# EAGLE schematic snesram (EAGLE 5.06)
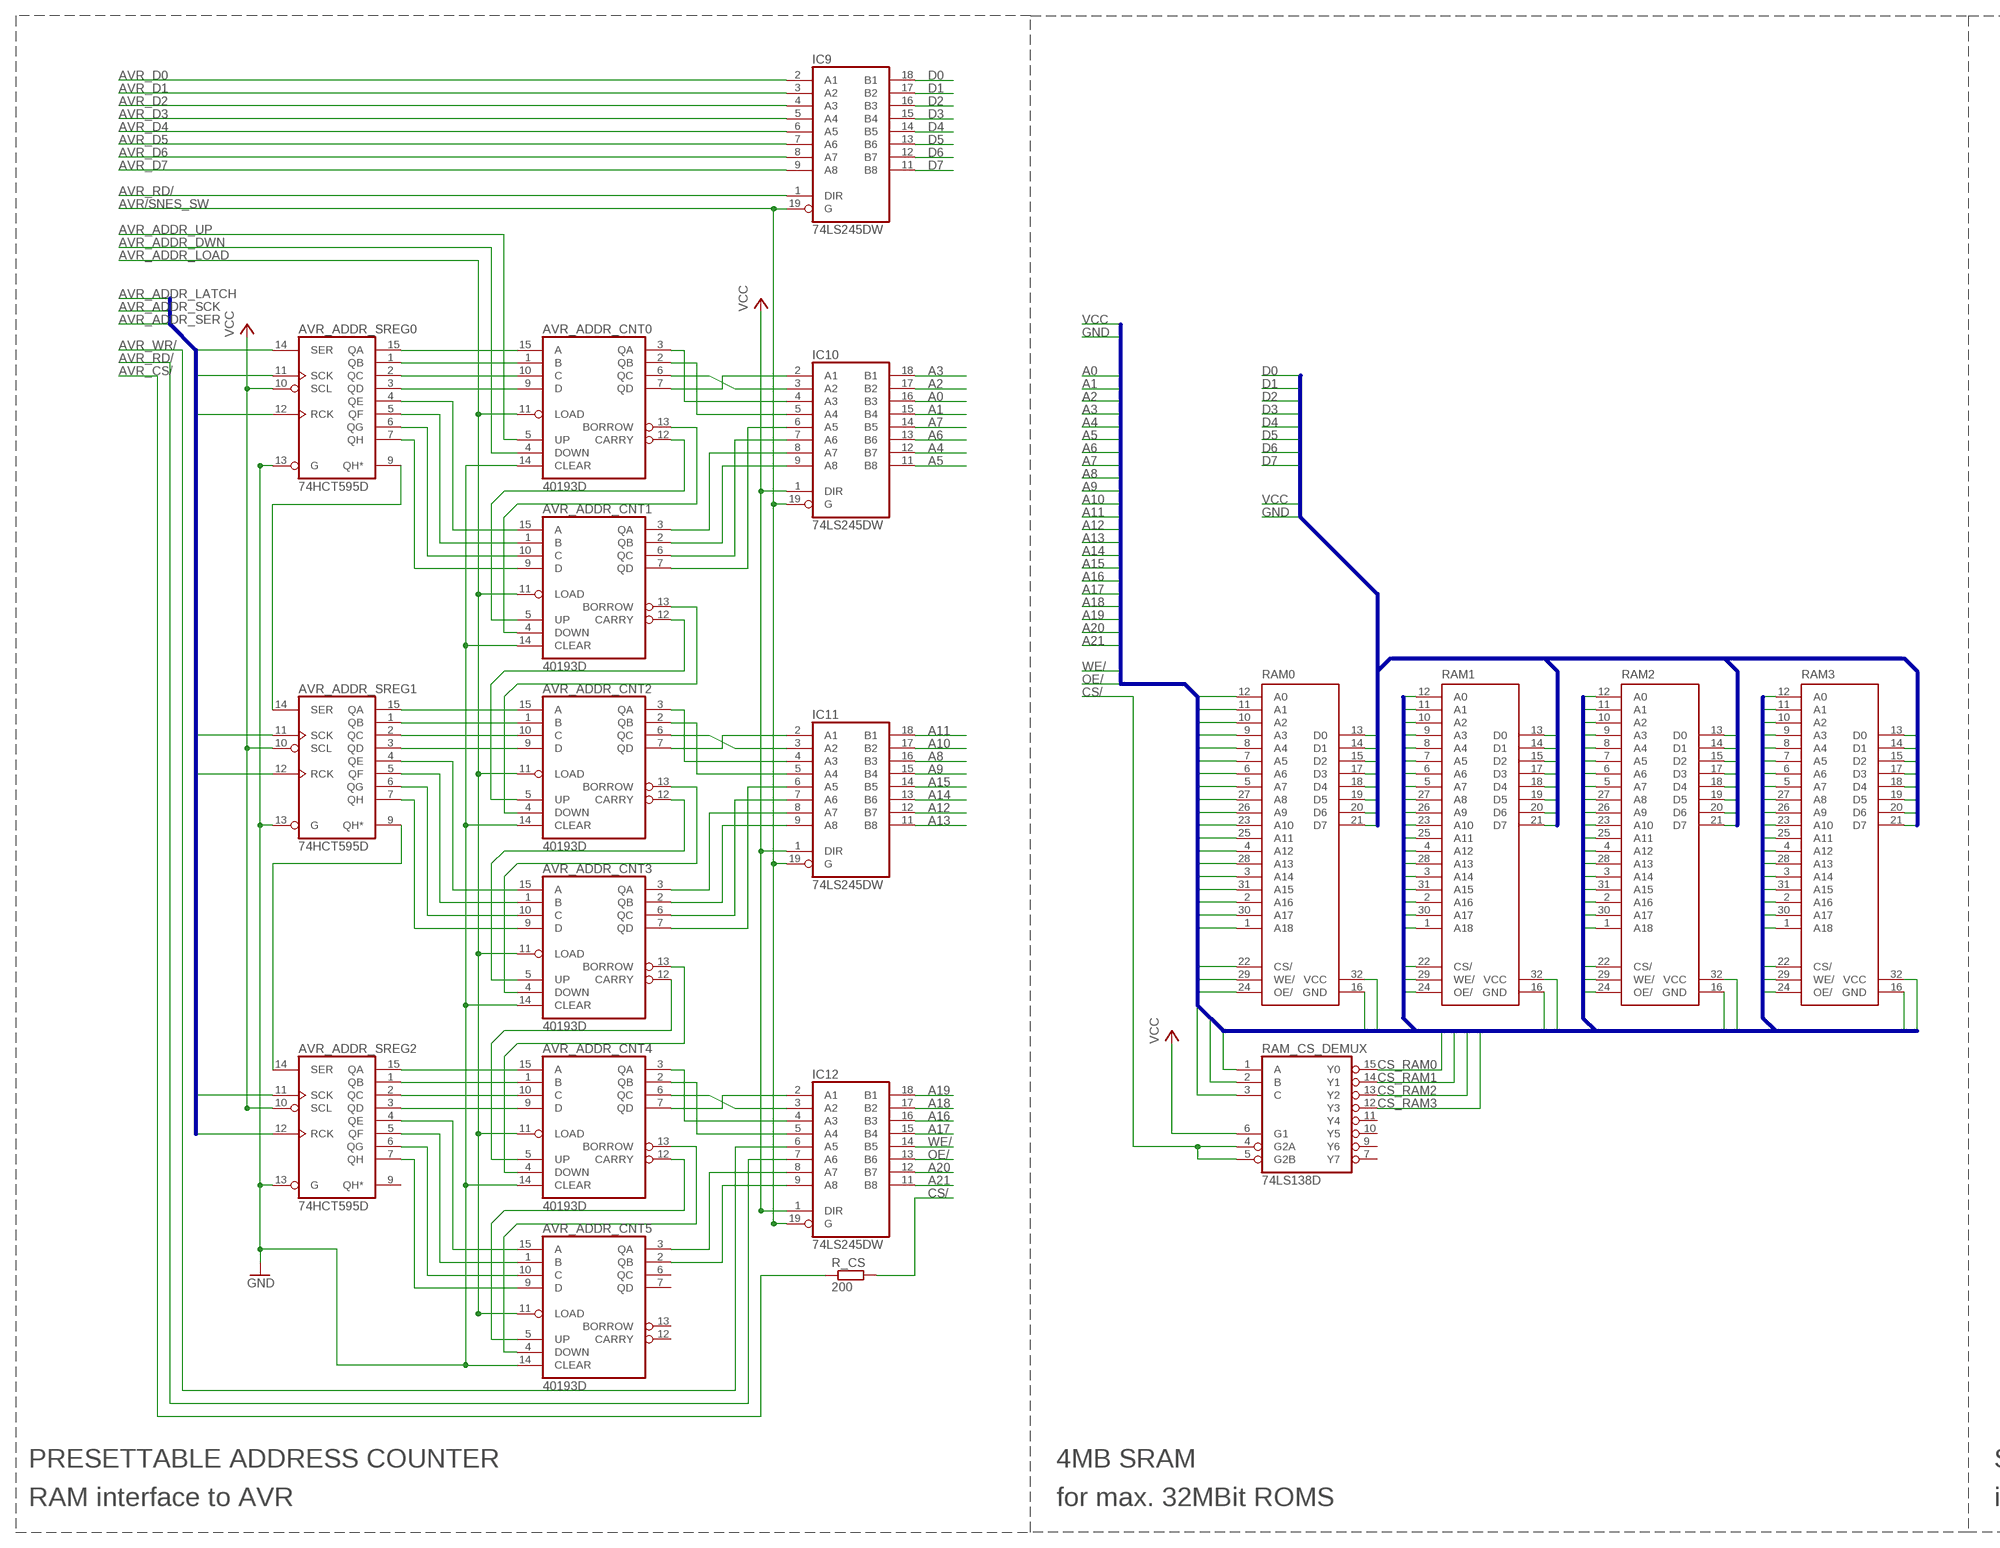
[diagram p0: schematic, sheet 1, part 1 of 2]
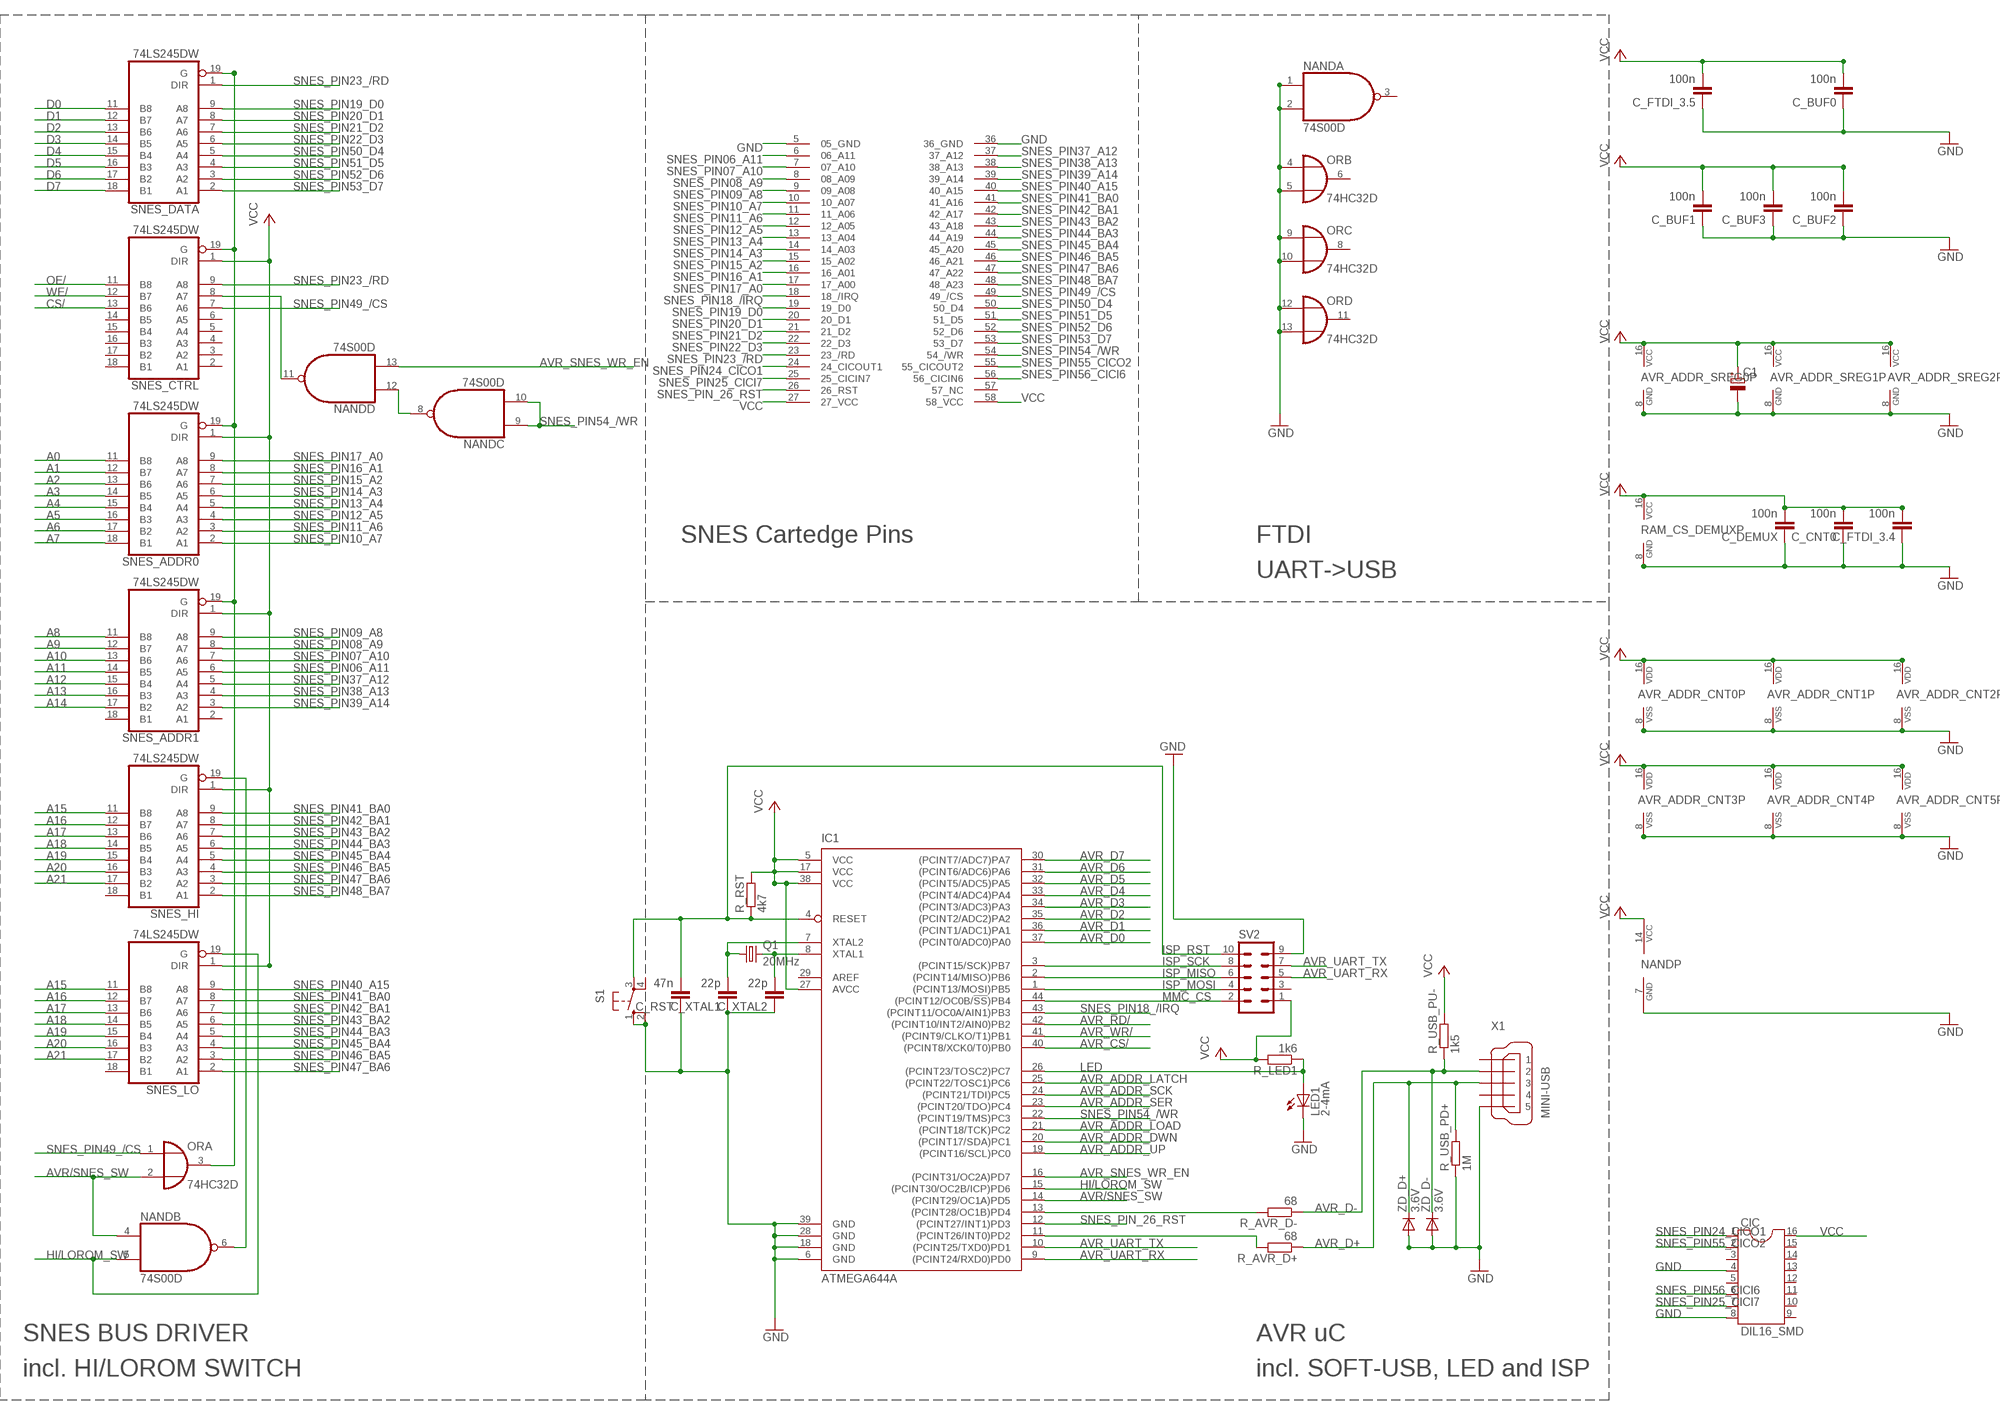
[diagram p1: schematic, sheet 1, part 2 of 2]

## Parts
AVR_ADDR_CNT0  40193D  [SO16]
AVR_ADDR_CNT1  40193D  [SO16]
AVR_ADDR_CNT2  40193D  [SO16]
AVR_ADDR_CNT3  40193D  [SO16]
AVR_ADDR_CNT4  40193D  [SO16]
AVR_ADDR_CNT5  40193D  [SO16]
AVR_ADDR_SREG0  74HCT595D  [SO16]
AVR_ADDR_SREG1  74HCT595D  [SO16]
AVR_ADDR_SREG2  74HCT595D  [SO16]
C1  CPOL-EUSMCC  [SMC_C]
C_BUF0  100n  C-EUC0805  [C0805]
C_BUF1  100n  C-EUC0805  [C0805]
C_BUF2  100n  C-EUC0805  [C0805]
C_BUF3  100n  C-EUC0805  [C0805]
C_CNT0  100n  C-EUC0805  [C0805]
C_DEMUX  100n  C-EUC0805  [C0805]
C_FTDI_3.4  100n  C-EUC0805  [C0805]
C_FTDI_3.5  100n  C-EUC0805  [C0805]
C_RST  47n  C-EUC0805  [C0805]
C_XTAL1  22p  C-EUC0805  [C0805]
C_XTAL2  22p  C-EUC0805  [C0805]
CIC  DIL16_SMD  [DIL16_SMD]
IC1  ATMEGA644A  [TQFP44]
IC9  74LS245DW  [SO20W]
IC10  74LS245DW  [SO20W]
IC11  74LS245DW  [SO20W]
IC12  74LS245DW  [SO20W]
LED1  2-4mA  LEDCHIPLED_0805  [CHIPLED_0805]
NAND  74S00D  [SO14]
OR  74HC32D  [SO14]
Q1  20MHz  CRYSTALHC49UP  [HC49UP]
R_AVR_D+  68  R-EU_R0805  [R0805]
R_AVR_D-  68  R-EU_R0805  [R0805]
R_CS  200  R-EU_R0805  [R0805]
R_LED1  1k6  R-EU_R0805  [R0805]
R_RST  4k7  R-EU_R0805  [R0805]
R_USB_PD+  1M  R-EU_R0805  [R0805]
R_USB_PU-  1k5  R-EU_R0805  [R0805]
RAM0  KM628512-XX  [SOP-32]
RAM1  KM628512-XX  [SOP-32]
RAM2  KM628512-XX  [SOP-32]
RAM3  KM628512-XX  [SOP-32]
RAM_CS_DEMUX  74LS138D  [SO16]
S1  10-XX  [B3F-10XX]
SNES_ADDR0  74LS245DW  [SO20W]
SNES_ADDR1  74LS245DW  [SO20W]
SNES_CTRL  74LS245DW  [SO20W]
SNES_DATA  74LS245DW  [SO20W]
SNES_HI  74LS245DW  [SO20W]
SNES_LO  74LS245DW  [SO20W]
SV2  ML10  [ML10]
U$3  SNES_CON_FRONT  [SNES_CON]
X1  MINI-USB  MINI-USB-32005-201  [32005-201]
ZD_D+  3.6V  DIODE-MINIMELF  [MINIMELF]
ZD_D-  3.6V  DIODE-MINIMELF  [MINIMELF]

## Nets
A0: IC10.16(B3) RAM0.12(A0) RAM1.12(A0) RAM2.12(A0) RAM3.12(A0) SNES_ADDR0.11(B8)
A1: IC10.15(B4) RAM0.11(A1) RAM1.11(A1) RAM2.11(A1) RAM3.11(A1) SNES_ADDR0.12(B7)
A2: IC10.17(B2) RAM0.10(A2) RAM1.10(A2) RAM2.10(A2) RAM3.10(A2) SNES_ADDR0.13(B6)
A3: IC10.18(B1) RAM0.9(A3) RAM1.9(A3) RAM2.9(A3) RAM3.9(A3) SNES_ADDR0.14(B5)
A4: IC10.12(B7) RAM0.8(A4) RAM1.8(A4) RAM2.8(A4) RAM3.8(A4) SNES_ADDR0.15(B4)
A5: IC10.11(B8) RAM0.7(A5) RAM1.7(A5) RAM2.7(A5) RAM3.7(A5) SNES_ADDR0.16(B3)
A6: IC10.13(B6) RAM0.6(A6) RAM1.6(A6) RAM2.6(A6) RAM3.6(A6) SNES_ADDR0.17(B2)
A7: IC10.14(B5) RAM0.5(A7) RAM1.5(A7) RAM2.5(A7) RAM3.5(A7) SNES_ADDR0.18(B1)
A8: IC11.16(B3) RAM0.27(A8) RAM1.27(A8) RAM2.27(A8) RAM3.27(A8) SNES_ADDR1.11(B8)
A9: IC11.15(B4) RAM0.26(A9) RAM1.26(A9) RAM2.26(A9) RAM3.26(A9) SNES_ADDR1.12(B7)
A10: IC11.17(B2) RAM0.23(A10) RAM1.23(A10) RAM2.23(A10) RAM3.23(A10) SNES_ADDR1.13(B6)
A11: IC11.18(B1) RAM0.25(A11) RAM1.25(A11) RAM2.25(A11) RAM3.25(A11) SNES_ADDR1.14(B5)
A12: IC11.12(B7) RAM0.4(A12) RAM1.4(A12) RAM2.4(A12) RAM3.4(A12) SNES_ADDR1.15(B4)
A13: IC11.11(B8) RAM0.28(A13) RAM1.28(A13) RAM2.28(A13) RAM3.28(A13) SNES_ADDR1.16(B3)
A14: IC11.13(B6) RAM0.3(A14) RAM1.3(A14) RAM2.3(A14) RAM3.3(A14) SNES_ADDR1.17(B2)
A15: IC11.14(B5) RAM0.31(A15) RAM1.31(A15) RAM2.31(A15) RAM3.31(A15) SNES_HI.11(B8) SNES_LO.11(B8)
A16: IC12.16(B3) RAM0.2(A16) RAM1.2(A16) RAM2.2(A16) RAM3.2(A16) SNES_HI.12(B7) SNES_LO.12(B7)
A17: IC12.15(B4) RAM0.30(A17) RAM1.30(A17) RAM2.30(A17) RAM3.30(A17) SNES_HI.13(B6) SNES_LO.13(B6)
A18: IC12.17(B2) RAM0.1(A18) RAM1.1(A18) RAM2.1(A18) RAM3.1(A18) SNES_HI.14(B5) SNES_LO.14(B5)
A19: IC12.18(B1) RAM_CS_DEMUX.1(A) SNES_HI.15(B4) SNES_LO.15(B4)
A20: IC12.12(B7) RAM_CS_DEMUX.2(B) SNES_HI.16(B3) SNES_LO.16(B3)
A21: IC12.11(B8) RAM_CS_DEMUX.3(C) SNES_HI.17(B2) SNES_LO.17(B2)
AVR/SNES_SW: IC1.14((PCINT29/OC1A)PD5) IC9.19(G) IC10.19(G) IC11.19(G) IC12.19(G) NAND.4(B:I0) OR.2(A:I1)
AVR/SNES_SW_INV: OR.3(A:O) SNES_ADDR0.19(G) SNES_ADDR1.19(G) SNES_CTRL.19(G) SNES_DATA.19(G)
AVR_ADDR_DWN: AVR_ADDR_CNT0.4(DOWN) IC1.20((PCINT17/SDA)PC1)
AVR_ADDR_LATCH: AVR_ADDR_SREG0.12(RCK) AVR_ADDR_SREG1.12(RCK) AVR_ADDR_SREG2.12(RCK) IC1.25((PCINT22/TOSC1)PC6)
AVR_ADDR_LOAD: AVR_ADDR_CNT0.11(LOAD) AVR_ADDR_CNT1.11(LOAD) AVR_ADDR_CNT2.11(LOAD) AVR_ADDR_CNT3.11(LOAD) AVR_ADDR_CNT4.11(LOAD) AVR_ADDR_CNT5.11(LOAD) IC1.21((PCINT18/TCK)PC2)
AVR_ADDR_SCK: AVR_ADDR_SREG0.11(SCK) AVR_ADDR_SREG1.11(SCK) AVR_ADDR_SREG2.11(SCK) IC1.24((PCINT21/TDI)PC5)
AVR_ADDR_SER: AVR_ADDR_SREG0.14(SER) IC1.23((PCINT20/TDO)PC4)
AVR_ADDR_UP: AVR_ADDR_CNT0.5(UP) IC1.19((PCINT16/SCL)PC0)
AVR_CS/: IC1.40((PCINT8/XCK0/T0)PB0) R_CS.1
AVR_D0: IC1.37((PCINT0/ADC0)PA0) IC9.2(A1)
AVR_D1: IC1.36((PCINT1/ADC1)PA1) IC9.3(A2)
AVR_D2: IC1.35((PCINT2/ADC2)PA2) IC9.4(A3)
AVR_D3: IC1.34((PCINT3/ADC3)PA3) IC9.5(A4)
AVR_D4: IC1.33((PCINT4/ADC4)PA4) IC9.6(A5)
AVR_D5: IC1.32((PCINT5/ADC5)PA5) IC9.7(A6)
AVR_D6: IC1.31((PCINT6/ADC6)PA6) IC9.8(A7)
AVR_D7: IC1.30((PCINT7/ADC7)PA7) IC9.9(A8)
AVR_D+: R_AVR_D+.1 R_USB_PD+.2 X1.3 ZD_D+.C
AVR_D-: R_AVR_D-.1 R_USB_PU-.1 X1.2 ZD_D-.C
AVR_RD/: IC1.42((PCINT10/INT2/AIN0)PB2) IC9.1(DIR) IC12.7(A6)
AVR_SNES_WR_EN: IC1.16((PCINT31/OC2A)PD7) NAND.13(D:I1)
AVR_UART_RX: IC1.9((PCINT24/RXD0)PD0) SV2.5
AVR_UART_TX: IC1.10((PCINT25/TXD0)PD1) SV2.7
AVR_WR/: IC1.41((PCINT9/CLKO/T1)PB1) IC12.6(A5)
CS/: R_CS.2 RAM_CS_DEMUX.4(G2A) RAM_CS_DEMUX.5(G2B) SNES_CTRL.13(B6)
CS_RAM0: RAM0.22(CS/) RAM_CS_DEMUX.15(Y0)
CS_RAM1: RAM1.22(CS/) RAM_CS_DEMUX.14(Y1)
CS_RAM2: RAM2.22(CS/) RAM_CS_DEMUX.13(Y2)
CS_RAM3: RAM3.22(CS/) RAM_CS_DEMUX.12(Y3)
D0: IC9.18(B1) RAM0.13(D0) RAM1.13(D0) RAM2.13(D0) RAM3.13(D0) SNES_DATA.11(B8)
D1: IC9.17(B2) RAM0.14(D1) RAM1.14(D1) RAM2.14(D1) RAM3.14(D1) SNES_DATA.12(B7)
D2: IC9.16(B3) RAM0.15(D2) RAM1.15(D2) RAM2.15(D2) RAM3.15(D2) SNES_DATA.13(B6)
D3: IC9.15(B4) RAM0.17(D3) RAM1.17(D3) RAM2.17(D3) RAM3.17(D3) SNES_DATA.14(B5)
D4: IC9.14(B5) RAM0.18(D4) RAM1.18(D4) RAM2.18(D4) RAM3.18(D4) SNES_DATA.15(B4)
D5: IC9.13(B6) RAM0.19(D5) RAM1.19(D5) RAM2.19(D5) RAM3.19(D5) SNES_DATA.16(B3)
D6: IC9.12(B7) RAM0.20(D6) RAM1.20(D6) RAM2.20(D6) RAM3.20(D6) SNES_DATA.17(B2)
D7: IC9.11(B8) RAM0.21(D7) RAM1.21(D7) RAM2.21(D7) RAM3.21(D7) SNES_DATA.18(B1)
GND: AVR_ADDR_CNT0.8(VSS) AVR_ADDR_CNT0.14(CLEAR) AVR_ADDR_CNT1.8(VSS) AVR_ADDR_CNT1.14(CLEAR) AVR_ADDR_CNT2.8(VSS) AVR_ADDR_CNT2.14(CLEAR) AVR_ADDR_CNT3.8(VSS) AVR_ADDR_CNT3.14(CLEAR) AVR_ADDR_CNT4.8(VSS) AVR_ADDR_CNT4.14(CLEAR) AVR_ADDR_CNT5.8(VSS) AVR_ADDR_CNT5.14(CLEAR) AVR_ADDR_SREG0.8(GND) AVR_ADDR_SREG0.13(G) AVR_ADDR_SREG1.8(GND) AVR_ADDR_SREG1.13(G) AVR_ADDR_SREG2.8(GND) AVR_ADDR_SREG2.13(G) C1.- C_BUF0.1 C_BUF1.1 C_BUF2.1 C_BUF3.1 C_CNT0.1 C_DEMUX.1 C_FTDI_3.4.1 C_FTDI_3.5.1 C_RST.1 C_XTAL1.1 C_XTAL2.1 CIC.4 CIC.8 IC1.6(GND) IC1.18(GND) IC1.28(GND) IC1.39(GND) LED1.C NAND.1(A:I0) NAND.2(A:I1) NAND.7(P:GND) OR.4(B:I0) OR.5(B:I1) OR.9(C:I0) OR.10(C:I1) OR.12(D:I0) OR.13(D:I1) R_USB_PD+.1 RAM0.16(GND) RAM1.16(GND) RAM2.16(GND) RAM3.16(GND) RAM_CS_DEMUX.8(GND) S1.1(S) S1.2(S1) SV2.9 U$3.5(05_GND) U$3.36(36_GND) X1.5 ZD_D+.A ZD_D-.A
HI/LOROM_SW: IC1.15((PCINT30/OC2B/ICP)PD6) NAND.5(B:I1) SNES_LO.19(G)
HI/LOROM_SW_INV: NAND.6(B:O) SNES_HI.19(G)
ISP_MISO: IC1.2((PCINT14/MISO)PB6) SV2.6
ISP_MOSI: IC1.1((PCINT13/MOSI)PB5) SV2.4
ISP_RST: C_RST.2 IC1.4(RESET) R_RST.1 S1.3(P) SV2.10
ISP_SCK: IC1.3((PCINT15/SCK)PB7) SV2.8
LED: IC1.26((PCINT23/TOSC2)PC7) LED1.A R_LED1.1
MMC_CS: IC1.44((PCINT12/OC0B/!SS!)PB4) SV2.2
N$1: AVR_ADDR_CNT0.7(QD) IC10.2(A1)
N$2: AVR_ADDR_CNT2.3(QA) IC11.4(A3)
N$3: AVR_ADDR_CNT0.2(QB) IC10.5(A4)
N$4: AVR_ADDR_CNT0.3(QA) IC10.4(A3)
N$5: AVR_ADDR_CNT1.7(QD) IC10.6(A5)
N$6: AVR_ADDR_CNT1.6(QC) IC10.7(A6)
N$7: AVR_ADDR_CNT1.2(QB) IC10.9(A8)
N$8: AVR_ADDR_CNT1.3(QA) IC10.8(A7)
N$9: AVR_ADDR_CNT0.12(CARRY) AVR_ADDR_CNT1.5(UP)
N$10: AVR_ADDR_CNT0.13(BORROW) AVR_ADDR_CNT1.4(DOWN)
N$11: AVR_ADDR_SREG0.9(QH*) AVR_ADDR_SREG1.14(SER)
N$12: AVR_ADDR_CNT0.15(A) AVR_ADDR_SREG0.15(QA)
N$13: AVR_ADDR_CNT0.1(B) AVR_ADDR_SREG0.1(QB)
N$14: AVR_ADDR_CNT0.10(C) AVR_ADDR_SREG0.2(QC)
N$15: AVR_ADDR_CNT0.9(D) AVR_ADDR_SREG0.3(QD)
N$16: AVR_ADDR_CNT1.15(A) AVR_ADDR_SREG0.4(QE)
N$17: AVR_ADDR_CNT1.1(B) AVR_ADDR_SREG0.5(QF)
N$18: AVR_ADDR_CNT1.10(C) AVR_ADDR_SREG0.6(QG)
N$19: AVR_ADDR_CNT1.9(D) AVR_ADDR_SREG0.7(QH)
N$20: AVR_ADDR_CNT3.9(D) AVR_ADDR_SREG1.7(QH)
N$21: AVR_ADDR_CNT2.1(B) AVR_ADDR_SREG1.1(QB)
N$22: AVR_ADDR_CNT2.10(C) AVR_ADDR_SREG1.2(QC)
N$23: AVR_ADDR_CNT2.9(D) AVR_ADDR_SREG1.3(QD)
N$24: AVR_ADDR_CNT1.12(CARRY) AVR_ADDR_CNT2.5(UP)
N$25: AVR_ADDR_CNT1.13(BORROW) AVR_ADDR_CNT2.4(DOWN)
N$26: AVR_ADDR_CNT2.2(QB) IC11.5(A4)
N$27: AVR_ADDR_CNT2.6(QC) IC11.3(A2)
N$28: AVR_ADDR_CNT2.7(QD) IC11.2(A1)
N$29: AVR_ADDR_CNT4.3(QA) IC12.4(A3)
N$30: AVR_ADDR_CNT3.15(A) AVR_ADDR_SREG1.4(QE)
N$31: AVR_ADDR_CNT3.1(B) AVR_ADDR_SREG1.5(QF)
N$32: AVR_ADDR_CNT3.10(C) AVR_ADDR_SREG1.6(QG)
N$33: AVR_ADDR_CNT3.3(QA) IC11.8(A7)
N$34: AVR_ADDR_CNT3.2(QB) IC11.9(A8)
N$35: AVR_ADDR_CNT3.6(QC) IC11.7(A6)
N$36: AVR_ADDR_CNT3.7(QD) IC11.6(A5)
N$37: AVR_ADDR_CNT2.15(A) AVR_ADDR_SREG1.15(QA)
N$38: AVR_ADDR_SREG1.9(QH*) AVR_ADDR_SREG2.14(SER)
N$39: AVR_ADDR_CNT2.12(CARRY) AVR_ADDR_CNT3.5(UP)
N$40: AVR_ADDR_CNT2.13(BORROW) AVR_ADDR_CNT3.4(DOWN)
N$41: AVR_ADDR_CNT3.12(CARRY) AVR_ADDR_CNT4.5(UP)
N$42: AVR_ADDR_CNT3.13(BORROW) AVR_ADDR_CNT4.4(DOWN)
N$43: AVR_ADDR_CNT4.2(QB) IC12.5(A4)
N$44: AVR_ADDR_CNT4.6(QC) IC12.3(A2)
N$45: AVR_ADDR_CNT4.7(QD) IC12.2(A1)
N$46: NAND.8(C:O) NAND.12(D:I0)
N$47: AVR_ADDR_CNT4.12(CARRY) AVR_ADDR_CNT5.5(UP)
N$48: AVR_ADDR_CNT4.13(BORROW) AVR_ADDR_CNT5.4(DOWN)
N$49: AVR_ADDR_CNT5.3(QA) IC12.8(A7)
N$50: AVR_ADDR_CNT5.2(QB) IC12.9(A8)
N$52: NAND.11(D:O) SNES_CTRL.8(A7)
N$53: AVR_ADDR_CNT4.15(A) AVR_ADDR_SREG2.15(QA)
N$54: AVR_ADDR_CNT4.1(B) AVR_ADDR_SREG2.1(QB)
N$55: AVR_ADDR_CNT4.10(C) AVR_ADDR_SREG2.2(QC)
N$56: AVR_ADDR_CNT4.9(D) AVR_ADDR_SREG2.3(QD)
N$57: AVR_ADDR_CNT5.15(A) AVR_ADDR_SREG2.4(QE)
N$58: AVR_ADDR_CNT5.1(B) AVR_ADDR_SREG2.5(QF)
N$59: AVR_ADDR_CNT5.10(C) AVR_ADDR_SREG2.6(QG)
N$60: AVR_ADDR_CNT5.9(D) AVR_ADDR_SREG2.7(QH)
N$61: IC1.13((PCINT28/OC1B)PD4) R_AVR_D-.2
N$62: IC1.11((PCINT26/INT0)PD2) R_AVR_D+.2
N$63: C_XTAL2.2 IC1.8(XTAL1) Q1.2
N$64: AVR_ADDR_CNT0.6(QC) IC10.3(A2)
N$68: C_XTAL1.2 IC1.7(XTAL2) Q1.1
OE/: IC12.13(B6) RAM0.24(OE/) RAM1.24(OE/) RAM2.24(OE/) RAM3.24(OE/) SNES_CTRL.11(B8)
SNES_PIN06_A11: SNES_ADDR1.6(A5) U$3.6(06_A11)
SNES_PIN07_A10: SNES_ADDR1.7(A6) U$3.7(07_A10)
SNES_PIN08_A9: SNES_ADDR1.8(A7) U$3.8(08_A09)
SNES_PIN09_A8: SNES_ADDR1.9(A8) U$3.9(09_A08)
SNES_PIN10_A7: SNES_ADDR0.2(A1) U$3.10(10_A07)
SNES_PIN11_A6: SNES_ADDR0.3(A2) U$3.11(11_A06)
SNES_PIN12_A5: SNES_ADDR0.4(A3) U$3.12(12_A05)
SNES_PIN13_A4: SNES_ADDR0.5(A4) U$3.13(13_A04)
SNES_PIN14_A3: SNES_ADDR0.6(A5) U$3.14(14_A03)
SNES_PIN15_A2: SNES_ADDR0.7(A6) U$3.15(15_A02)
SNES_PIN16_A1: SNES_ADDR0.8(A7) U$3.16(16_A01)
SNES_PIN17_A0: SNES_ADDR0.9(A8) U$3.17(17_A00)
SNES_PIN18_/IRQ: IC1.43((PCINT11/OC0A/AIN1)PB3) U$3.18(18_/IRQ)
SNES_PIN19_D0: SNES_DATA.9(A8) U$3.19(19_D0)
SNES_PIN20_D1: SNES_DATA.8(A7) U$3.20(20_D1)
SNES_PIN21_D2: SNES_DATA.7(A6) U$3.21(21_D2)
SNES_PIN22_D3: SNES_DATA.6(A5) U$3.22(22_D3)
SNES_PIN23_/RD: SNES_CTRL.9(A8) SNES_DATA.1(DIR) U$3.23(23_/RD)
SNES_PIN24_CICO1: CIC.1 U$3.24(24_CICOUT1)
SNES_PIN25_CICI7: CIC.7 U$3.25(25_CICIN7)
SNES_PIN37_A12: SNES_ADDR1.5(A4) U$3.37(37_A12)
SNES_PIN38_A13: SNES_ADDR1.4(A3) U$3.38(38_A13)
SNES_PIN39_A14: SNES_ADDR1.3(A2) U$3.39(39_A14)
SNES_PIN40_A15: SNES_LO.9(A8) U$3.40(40_A15)
SNES_PIN41_BA0: SNES_HI.9(A8) SNES_LO.8(A7) U$3.41(41_A16)
SNES_PIN42_BA1: SNES_HI.8(A7) SNES_LO.7(A6) U$3.42(42_A17)
SNES_PIN43_BA2: SNES_HI.7(A6) SNES_LO.6(A5) U$3.43(43_A18)
SNES_PIN44_BA3: SNES_HI.6(A5) SNES_LO.5(A4) U$3.44(44_A19)
SNES_PIN45_BA4: SNES_HI.5(A4) SNES_LO.4(A3) U$3.45(45_A20)
SNES_PIN46_BA5: SNES_HI.4(A3) SNES_LO.3(A2) U$3.46(46_A21)
SNES_PIN47_BA6: SNES_HI.3(A2) SNES_LO.2(A1) U$3.47(47_A22)
SNES_PIN48_BA7: SNES_HI.2(A1) U$3.48(48_A23)
SNES_PIN49_/CS: OR.1(A:I0) SNES_CTRL.7(A6) U$3.49(49_/CS)
SNES_PIN50_D4: SNES_DATA.5(A4) U$3.50(50_D4)
SNES_PIN51_D5: SNES_DATA.4(A3) U$3.51(51_D5)
SNES_PIN52_D6: SNES_DATA.3(A2) U$3.52(52_D6)
SNES_PIN53_D7: SNES_DATA.2(A1) U$3.53(53_D7)
SNES_PIN54_/WR: IC1.22((PCINT19/TMS)PC3) NAND.9(C:I0) NAND.10(C:I1) U$3.54(54_/WR)
SNES_PIN55_CICO2: CIC.2 U$3.55(55_CICOUT2)
SNES_PIN56_CICI6: CIC.6 U$3.56(56_CICIN6)
SNES_PIN_26_RST: IC1.12((PCINT27/INT1)PD3) U$3.26(26_RST)
VCC: AVR_ADDR_CNT0.16(VDD) AVR_ADDR_CNT1.16(VDD) AVR_ADDR_CNT2.16(VDD) AVR_ADDR_CNT3.16(VDD) AVR_ADDR_CNT4.16(VDD) AVR_ADDR_CNT5.16(VDD) AVR_ADDR_SREG0.10(SCL) AVR_ADDR_SREG0.16(VCC) AVR_ADDR_SREG1.10(SCL) AVR_ADDR_SREG1.16(VCC) AVR_ADDR_SREG2.10(SCL) AVR_ADDR_SREG2.16(VCC) C1.+ C_BUF0.2 C_BUF1.2 C_BUF2.2 C_BUF3.2 C_CNT0.2 C_DEMUX.2 C_FTDI_3.4.2 C_FTDI_3.5.2 CIC.16 IC1.5(VCC) IC1.17(VCC) IC1.27(AVCC) IC1.38(VCC) IC10.1(DIR) IC11.1(DIR) IC12.1(DIR) NAND.14(P:VCC) R_LED1.2 R_RST.2 R_USB_PU-.2 RAM0.32(VCC) RAM1.32(VCC) RAM2.32(VCC) RAM3.32(VCC) RAM_CS_DEMUX.6(G1) RAM_CS_DEMUX.16(VCC) SNES_ADDR0.1(DIR) SNES_ADDR1.1(DIR) SNES_CTRL.1(DIR) SNES_HI.1(DIR) SNES_LO.1(DIR) SV2.1 U$3.27(27_VCC) U$3.58(58_VCC)
WE/: IC12.14(B5) RAM0.29(WE/) RAM1.29(WE/) RAM2.29(WE/) RAM3.29(WE/) SNES_CTRL.12(B7)
Unconnected: AVR_ADDR_CNT5.6(QC) AVR_ADDR_CNT5.7(QD) AVR_ADDR_CNT5.12(CARRY) AVR_ADDR_CNT5.13(BORROW) AVR_ADDR_SREG2.9(QH*) CIC.3 CIC.5 CIC.9 CIC.10 CIC.11 CIC.12 CIC.13 CIC.14 CIC.15 IC1.29(AREF) NAND.3(A:O) OR.6(B:O) OR.8(C:O) OR.11(D:O) RAM_CS_DEMUX.7(Y7) RAM_CS_DEMUX.9(Y6) RAM_CS_DEMUX.10(Y5) RAM_CS_DEMUX.11(Y4) S1.4(P1) SNES_ADDR1.2(A1) SNES_ADDR1.18(B1) SNES_CTRL.2(A1) SNES_CTRL.3(A2) SNES_CTRL.4(A3) SNES_CTRL.5(A4) SNES_CTRL.6(A5) SNES_CTRL.14(B5) SNES_CTRL.15(B4) SNES_CTRL.16(B3) SNES_CTRL.17(B2) SNES_CTRL.18(B1) SNES_HI.18(B1) SNES_LO.18(B1) SV2.3 U$3.57(57_NC) X1.1 X1.4

## Buses
ADDR:VCC,GND,A0,A1,A2,A3,A4,A5,A6,A7,A8,A9,A10,A11,A12,A13,A14,A15,A16,A17,A18,A19,A20,A21,CS_RAM0,CS_RAM1,CS_RAM2,CS_RAM3,WE/,OE/
DATA:VCC,GND,D0,D1,D2,D3,D4,D5,D6,D7
SPI:AVR_ADDR_SER,AVR_ADDR_SCK,AVR_ADDR_LATCH

## Notes on the sheet
- SNES Cartedge Pins | FTDI
- UART->USB
- PRESETTABLE ADDRESS COUNTER | 4MB SRAM | SNES BUS DRIVER | AVR uC
- RAM interface to AVR | for max. 32MBit ROMS | incl. HI/LOROM SWITCH | incl. SOFT-USB, LED and ISP

## Power pins joined to a net without a drawn wire
GND: IC9.10(GND) IC10.10(GND) IC11.10(GND) IC12.10(GND) OR.7(P:GND) SNES_ADDR0.10(GND) SNES_ADDR1.10(GND) SNES_CTRL.10(GND) SNES_DATA.10(GND) SNES_HI.10(GND) SNES_LO.10(GND)
VCC: IC9.20(VCC) IC10.20(VCC) IC11.20(VCC) IC12.20(VCC) OR.14(P:VCC) SNES_ADDR0.20(VCC) SNES_ADDR1.20(VCC) SNES_CTRL.20(VCC) SNES_DATA.20(VCC) SNES_HI.20(VCC) SNES_LO.20(VCC)

## Library data of the parts
AVR_ADDR_CNT0 AVR_ADDR_CNT1-AVR_ADDR_CNT5 = 40xx:40193: Binary up down COUNTER
AVR_ADDR_SREG0 AVR_ADDR_SREG1 AVR_ADDR_SREG2 = 74xx-eu:74*595: 8-bit SHIFT REGISTER, output latch
C1 = rcl:CPOL-EU: POLARIZED CAPACITOR, European symbol
C_BUF0 C_BUF1-C_BUF3 C_CNT0 C_DEMUX C_FTDI_3.4 C_FTDI_3.5 C_RST C_XTAL1 C_XTAL2 = rcl:C-EU: CAPACITOR, European symbol
CIC = ic-package:DIL16_SMD
IC1 = atmel:ATMEGA644: 8-bit Microcontroller with 64K Bytes In-System Programmable Flash Source: http://www.atmel.com/dyn/resources/prod_documents/doc2593.pdf
IC9-IC12 SNES_ADDR0 SNES_ADDR1 SNES_CTRL SNES_DATA SNES_HI SNES_LO = 74xx-eu:74*245: Octal BUS TRANSCEIVER, 3-state
LED1 = led:LED: LED OSRAM: - CHIPLED LG R971, LG N971, LY N971, LG Q971, LY Q971, LO R971, LY R971 LH N974, LH R974 LS Q976, LO Q976, LY Q976 LO Q996 - Hyper CHIPLED LW Q18S LB Q993, LB Q99A, LB R99A - SideLED LS A670, LO A670, LY A670, LG A670, LP A670 LB A673, LV A673, LT A673, LW A673 LH A674 LY A675 LS A676, LA A676, LO A676, LY A676, LW A676 LS A679, LY A679, LG A679 - Hyper Micro SIDELED® LS Y876, LA Y876, LO Y876, LY Y876 LT Y87S - SmartLED LW L88C, LW L88S LB L89C, LB L89S, LG L890 LS L89K, LO L89K, LY L89K LS L896, LA L896, LO L896, LY L896 - TOPLED LS T670, LO T670, LY T670, LG T670, LP T670 LSG T670, LSP T670, LSY T670, LOP T670, LYG T670 LG T671, LOG T671, LSG T671 LB T673, LV T673, LT T673, LW T673 LH T674 LS T676, LA T676, LO T676, LY T676, LB T676, LH T676, LSB T676, LW T676 LB T67C, LV T67C, LT T67C, LS T67K, LO T67K, LY T67K, LW E67C LS E67B, LA E67B, LO E67B, LY E67B, LB E67C, LV E67C, LT E67C LW T67C LS T679, LY T679, LG T679 LS T770, LO T770, LY T770, LG T770, LP T770 LB T773, LV T773, LT T773, LW T773 LH T774 LS E675, LA E675, LY E675, LS T675 LS T776, LA T776, LO T776, LY T776, LB T776 LHGB T686 LT T68C, LB T68C - Hyper Mini TOPLED® LB M676 - Mini TOPLED Santana® LG M470 LS M47K, LO M47K, LY M47K Source: http://www.osram.convergy.de LUXEON: - LUMILED® LXK2-PW12-R00, LXK2-PW12-S00, LXK2-PW14-U00, LXK2-PW14-V00 LXK2-PM12-R00, LXK2-PM12-S00, LXK2-PM14-U00 LXK2-PE12-Q00, LXK2-PE12-R00, LXK2-PE12-S00, LXK2-PE14-T00, LXK2-PE14-U00 LXK2-PB12-K00, LXK2-PB12-L00, LXK2-PB12-M00, LXK2-PB14-N00, LXK2-PB14-P00, LXK2-PB14-Q00 LXK2-PR12-L00, LXK2-PR12-M00, LXK2-PR14-Q00, LXK2-PR14-R00 LXK2-PD12-Q00, LXK2-PD12-R00, LXK2-PD12-S00 LXK2-PH12-R00, LXK2-PH12-S00 LXK2-PL12-P00, LXK2-PL12-Q00, LXK2-PL12-R00 Source: www.luxeon.com KINGBRIGHT: KA-3528ASYC Source: www.kingbright.com
NAND = 74xx-us:74*00: Quad 2-input NAND gate
OR = 74xx-eu:74*32: Quad 2-input OR gate
Q1 = crystal:CRYSTAL: CRYSTAL
R_AVR_D+ R_AVR_D- R_LED1 R_RST R_USB_PD+ R_USB_PU- = rcl:R-EU_: RESISTOR, European symbol
R_CS = resistor:R-EU_: RESISTOR, European symbol
RAM0 RAM1-RAM3 = memory-samsung-2:KM628512-XX
RAM_CS_DEMUX = 74xx-eu:74*138: 3-line to 8-line DECODER/DEMULTIPLEXER
S1 = switch-omron:10-XX: OMRON SWITCH
SV2 = con-harting-ml:ML10: HARTING
U$3 = snes_con:SNES_CON_FRONT
X1 = con-cypressindustries:MINI-USB-: MINI USB-B Conector Source: www.cypressindustries.com
ZD_D+ ZD_D- = diode:DIODE-: DIODE